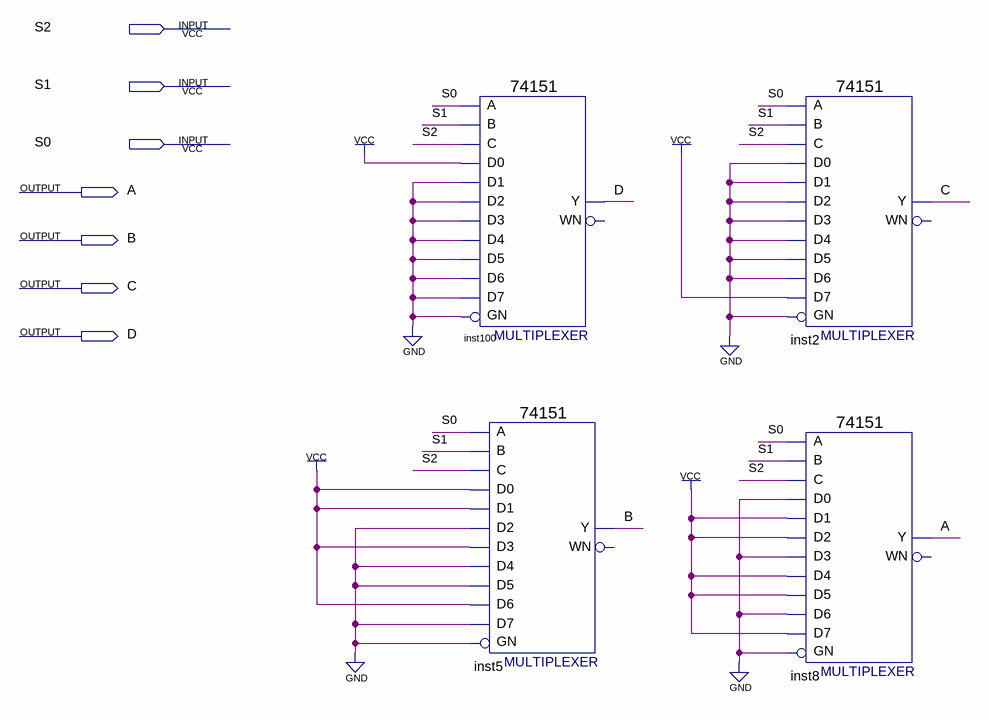
[diagram p0: schematic sheet]
// Quartus schematic HEX1.bdf as structural Verilog: 4 symbols, 7 pins
module HEX1 (
  input  S2,
  input  S1,
  input  S0,
  output A,
  output B,
  output C,
  output D
);

  \74151  inst100 (
    .GN(1'b0), .C(S2), .B(S1), .A(S0), .D5(1'b0), .D0(1'b1), .D1(1'b0), .D4(1'b0), .D3(1'b0), .D2(1'b0),
    .D6(1'b0), .D7(1'b0), .Y(D));  // open: WN
  \74151  inst5 (
    .GN(1'b0), .C(S2), .B(S1), .A(S0), .D5(1'b0), .D0(1'b1), .D1(1'b1), .D4(1'b0), .D3(1'b1), .D2(1'b0),
    .D6(1'b1), .D7(1'b0), .Y(B));  // open: WN
  \74151  inst2 (
    .GN(1'b0), .C(S2), .B(S1), .A(S0), .D5(1'b0), .D0(1'b0), .D1(1'b0), .D4(1'b0), .D3(1'b0), .D2(1'b0),
    .D6(1'b0), .D7(1'b1), .Y(C));  // open: WN
  \74151  inst8 (
    .GN(1'b0), .C(S2), .B(S1), .A(S0), .D5(1'b1), .D0(1'b0), .D1(1'b1), .D4(1'b1), .D3(1'b0), .D2(1'b1),
    .D6(1'b0), .D7(1'b1), .Y(A));  // open: WN
endmodule
